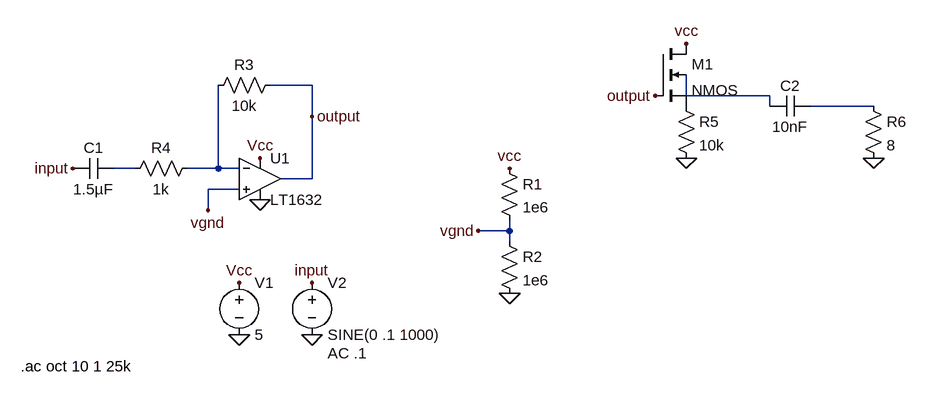
[diagram p0: schematic ltspice.asc]
ltspice.asc, the LTspice schematic file:
Version 4
SHEET 1 1048 680
WIRE 128 -64 64 -64
WIRE 704 -48 704 -80
WIRE 832 -48 704 -48
WIRE 832 -32 832 -48
WIRE 992 -32 896 -32
WIRE 128 -16 128 -64
WIRE -144 64 -176 64
WIRE -16 64 -16 -64
WIRE -16 64 -64 64
WIRE 16 64 -16 64
WIRE 128 80 128 -16
WIRE 128 80 80 80
WIRE 16 96 -32 96
WIRE -32 128 -32 96
WIRE 432 160 432 144
WIRE 432 160 384 160
WIRE 432 176 432 160
FLAG 432 256 0
FLAG 16 320 0
FLAG 128 320 0
FLAG 48 112 0
FLAG 48 48 Vcc
FLAG 16 240 Vcc
FLAG -32 128 vgnd
FLAG 384 160 vgnd
FLAG -240 64 input
FLAG 128 240 input
FLAG 128 -16 output
FLAG 432 64 vcc
FLAG 656 -48 output
FLAG 704 -128 vcc
FLAG 992 48 0
FLAG 704 48 0
SYMBOL voltage 16 224 R0
WINDOW 123 0 0 Left 2
WINDOW 39 0 0 Left 2
SYMATTR InstName V1
SYMATTR Value 5
SYMBOL voltage 128 224 R0
WINDOW 123 24 124 Left 2
WINDOW 39 0 0 Left 2
SYMATTR Value2 AC .1
SYMATTR InstName V2
SYMATTR Value SINE(0 .1 1000)
SYMBOL res 416 48 R0
SYMATTR InstName R1
SYMATTR Value 1e6
SYMBOL res 416 160 R0
SYMATTR InstName R2
SYMATTR Value 1e6
SYMBOL Opamps\\LT1632 48 16 R0
SYMATTR InstName U1
SYMBOL res -32 -48 R270
WINDOW 0 32 56 VTop 2
WINDOW 3 0 56 VBottom 2
SYMATTR InstName R3
SYMATTR Value 10k
SYMBOL res -160 80 R270
WINDOW 0 32 56 VTop 2
WINDOW 3 0 56 VBottom 2
SYMATTR InstName R4
SYMATTR Value 1k
SYMBOL cap -240 80 R270
WINDOW 0 32 32 VTop 2
WINDOW 3 0 32 VBottom 2
SYMATTR InstName C1
SYMATTR Value 1.5µF
SYMBOL nmos4 656 -128 R0
SYMATTR InstName M1
SYMBOL cap 832 -16 R270
WINDOW 0 32 32 VTop 2
WINDOW 3 0 32 VBottom 2
SYMATTR InstName C2
SYMATTR Value 10nF
SYMBOL res 976 -48 R0
SYMATTR InstName R6
SYMATTR Value 8
SYMBOL res 688 -48 R0
SYMATTR InstName R5
SYMATTR Value 10k
TEXT -320 368 Left 2 !.ac oct 10 1 25k

The netlist it stands for:
* ltspice.asc
V1 Vcc 0 5
V2 input 0 SINE(0 .1 1000) AC .1
R1 Vcc vgnd 1e6
R2 vgnd 0 1e6
XU1 vgnd N004 Vcc 0 output LT1632  ; pins In+ In- V+ V- OUT
R3 N004 output 10k
R4 N003 N004 1k
C1 input N003 1.5µF
M1 Vcc output P001 N001 NMOS
C2 N001 N002 10nF
R6 N002 0 8
R5 P001 0 10k
.model NMOS NMOS
.model PMOS PMOS
.lib standard.mos
.ac oct 10 1 25k
.lib LTC.lib
.backanno
.end